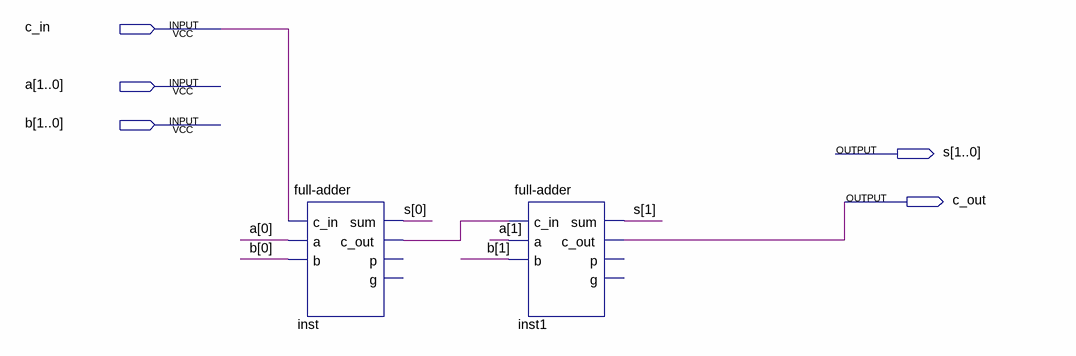
[diagram p0: schematic sheet]
// Quartus schematic cselecta_first_two.bdf as structural Verilog: 2 symbols, 5 pins
module cselecta_first_two (
  input  c_in,
  input  [1:0] a,
  input  [1:0] b,
  output [1:0] s,
  output c_out
);

  wire inst_c_out;

  \full-adder  inst (.c_in(c_in), .a(a[0]), .b(b[0]), .sum(s[0]), .c_out(inst_c_out));  // open: p, g
  \full-adder  inst1 (.c_in(inst_c_out), .a(a[1]), .b(b[1]), .sum(s[1]), .c_out(c_out));  // open: p, g
endmodule
